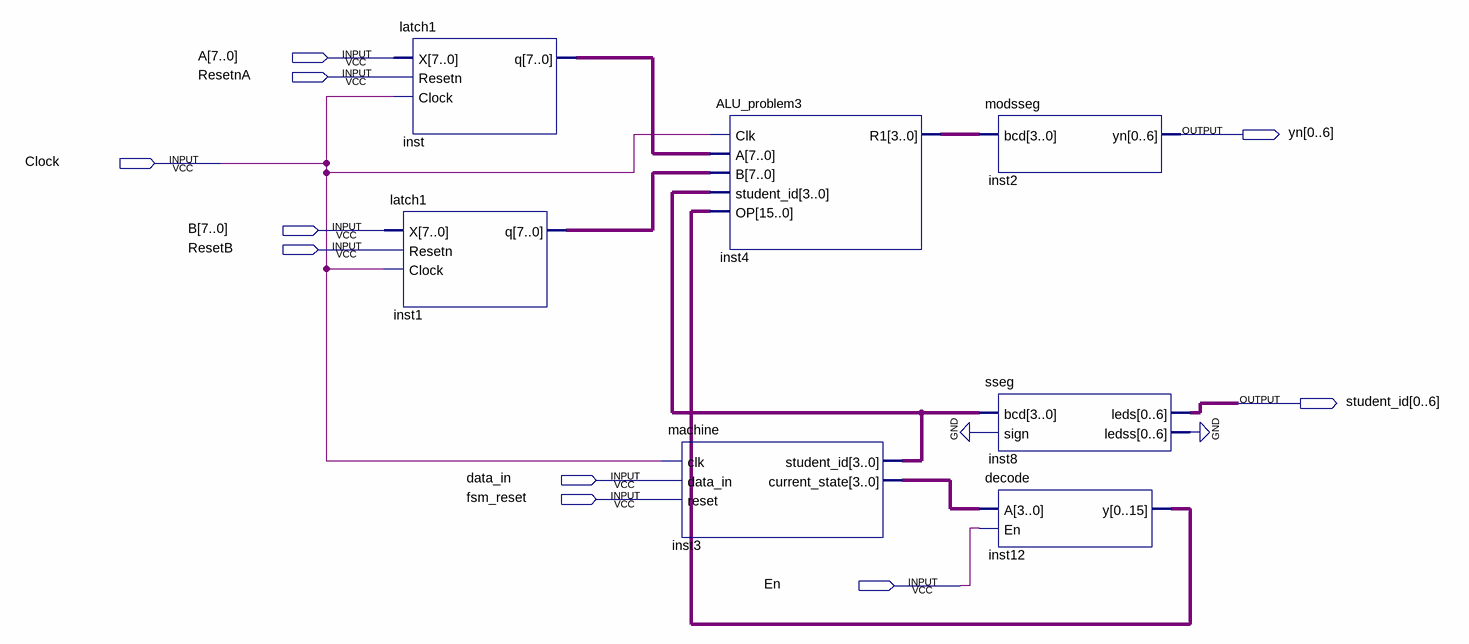
[diagram p0: schematic sheet]
// Quartus schematic problem3.bdf as structural Verilog: 7 symbols, 10 pins
module problem3 (
  input  [7:0] A,
  input  ResetnA,
  input  Clock,
  input  [7:0] B,
  input  ResetB,
  input  data_in,
  input  fsm_reset,
  input  En,
  output [0:6] yn,
  output [0:6] student_id
);

  wire [3:0] inst3_current_state, inst3_student_id, inst4_r1;
  wire [6:0] inst8_ledss;
  wire [7:0] inst1_q, inst_q;
  wire [15:0] inst12_y;

  latch1 inst (.X(A), .Resetn(ResetnA), .Clock(Clock), .q(inst_q));
  latch1 inst1 (.X(B), .Resetn(ResetB), .Clock(Clock), .q(inst1_q));
  machine inst3 (
    .clk(Clock), .data_in(data_in), .reset(fsm_reset), .student_id(inst3_student_id),
    .current_state(inst3_current_state));
  ALU_problem3 inst4 (
    .Clk(Clock), .A(inst_q), .B(inst1_q), .student_id(inst3_student_id), .OP(inst12_y), .R1(inst4_r1));
  modsseg inst2 (.bcd(inst4_r1), .yn(yn));
  sseg inst8 (.bcd(inst3_student_id), .sign(1'b0), .leds(student_id), .ledss(inst8_ledss));
  decode inst12 (.A(inst3_current_state), .En(En), .y(inst12_y));
  // also tied to GND on the sheet: {inst8_ledss[0], inst8_ledss[1], inst8_ledss[2], inst8_ledss[3], inst8_ledss[4], inst8_ledss[5], inst8_ledss[6]}
endmodule
